# Altium project ULP_USB.PrjPcb
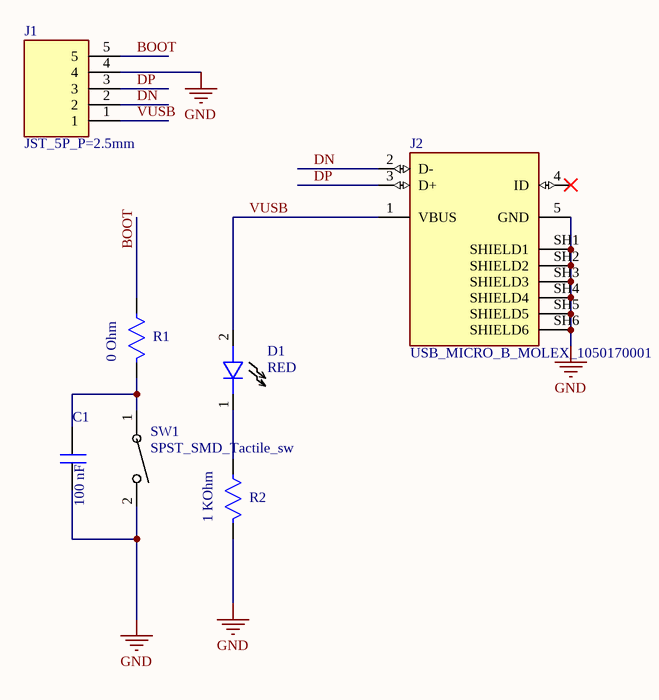
[diagram p0: Sheet1.SchDoc]
1 sheet, 7 parts. Net scope: global (net labels, ports and power ports of the same name join across sheets).
Board file: PCB1.PcbDoc

## Sheet Sheet1.SchDoc
size A4; SheetNumber: 1; SheetTotal: 1

### Parts
C1  100 nF  [CAP_0603]
D1  RED  [LED SMD 0603]
J1  JST_5P_P=2.5mm  [JST_5P_P=2.5mm]
J2  USB_MICRO_B_MOLEX_1050170001  [USB_MICRO_B_MOLEX_1050170001]
R1  0 Ohm  [Res_0603]
R2  1 KOhm  [Res_0603]
SW1  SPST_SMD_Tactile_sw  [SPST_SMD_6mm]

### Nets
GND: C1.1 J1.4 J2.5(GND) J2.SH1(SHIELD1) J2.SH2(SHIELD2) J2.SH3(SHIELD3) J2.SH4(SHIELD4) J2.SH5(SHIELD5) J2.SH6(SHIELD6) R2.1 SW1.2
BOOT: J1.5 R1.2
DN: J1.2 J2.2(D-)
DP: J1.3 J2.3(D+)
VUSB: D1.2 J1.1 J2.1(VBUS)
NetC1_2: C1.2 R1.1 SW1.1
NetD1_1: D1.1 R2.2

Not connected (* = marked no-connect by the designer): J2 4(ID)*

### Library data of the parts
C1 = Cap SMD: Cap SMD.
D1 = LED SMD: SMD LED
J1 = JST_5P_P=2.5mm: JST 1X5P , p=2.5mm XH connector, 5 way , Straight; Manufacturer_Name: JST (JAPAN SOLDERLESS TERMINALS); Manufacturer_Part_Number: B5B-XH-A(LF)(SN); Geometry.Height: 7mm; Mouser Part Number: N/A; Mouser Price/Stock: https://www.mouser.co.uk/ProductDetail/JST-Commercial/B5B-XH-ALFSN?qs=IKkN%2F947nfBtEhlRye3uAw%3D%3D; Arrow Part Number: B5B-XH-A(LF)(SN); Arrow Price/Stock: https://www.arrow.com/en/products/b5b-xh-a-lf-sn/jst-manufacturing; Datasheet Link: http://www.jst-mfg.com/product/pdf/eng/eXH.pdf; LCSC: C42422446
J2 = USB_MICRO_B_MOLEX_1050170001: USB - micro B USB 2.0 Receptacle Connector 5 Position Surface Mount, Right Angle; Through Hole; MF: Molex; SnapEDA_Link: https://www.snapeda.com/parts/1050170001/Molex/view-part/?ref=snap; Package: None; Value: *; MP: 1050170001; Check_prices: https://www.snapeda.com/parts/1050170001/Molex/view-part/?ref=eda; LCSC: C136000
R1 R2 = Res smd: SMD Resistor; MP: RC0805FR-07330RL; MF: Yageo; Package: 2012 Rohm Semiconductor; Value: *; SnapEDA_Link: https://www.snapeda.com/parts/RC0805FR-07330RL/Yageo/view-part/106115/?ref=snap; Price: None; Availability: Unavailable
SW1 = SPST_SMD_Tactile_sw: SPST SMD Tactile Switches Rectangle button Brick nogging; Mfr_Name: XKB Connectivity